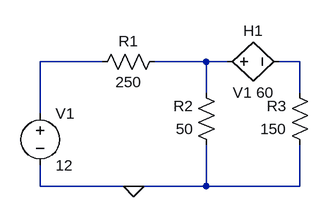
[diagram p0: schematic Draft9.asc]
Draft9.asc, the LTspice schematic file:
Version 4
SHEET 1 880 680
WIRE 128 112 32 112
WIRE 288 112 208 112
WIRE 320 112 288 112
WIRE 432 112 400 112
WIRE 288 160 288 112
WIRE 432 160 432 112
WIRE 32 192 32 112
WIRE 32 304 32 272
WIRE 176 304 32 304
WIRE 288 304 288 240
WIRE 288 304 176 304
WIRE 432 304 432 240
WIRE 432 304 288 304
FLAG 176 304 0
SYMBOL voltage 32 176 R0
SYMATTR InstName V1
SYMATTR Value 12
SYMBOL res 224 96 R90
WINDOW 0 0 56 VBottom 2
WINDOW 3 32 56 VTop 2
SYMATTR InstName R1
SYMATTR Value 250
SYMBOL res 304 256 R180
WINDOW 0 36 76 Left 2
WINDOW 3 36 40 Left 2
SYMATTR InstName R2
SYMATTR Value 50
SYMBOL res 448 256 R180
WINDOW 0 36 76 Left 2
WINDOW 3 36 40 Left 2
SYMATTR InstName R3
SYMATTR Value 150
SYMBOL h 304 112 R270
WINDOW 0 32 56 VTop 2
WINDOW 3 -32 56 VBottom 2
SYMATTR InstName H1
SYMATTR Value V1 60

The netlist it stands for:
* Draft9.asc
V1 N001 0 12
R1 N002 N001 250
R2 0 N002 50
R3 0 N003 150
H1 N002 N003 V1 60
.backanno
.end